# Altium schematic sheet Sheet2.SchDoc
size A3; SheetNumber: 2; SheetTotal: 3
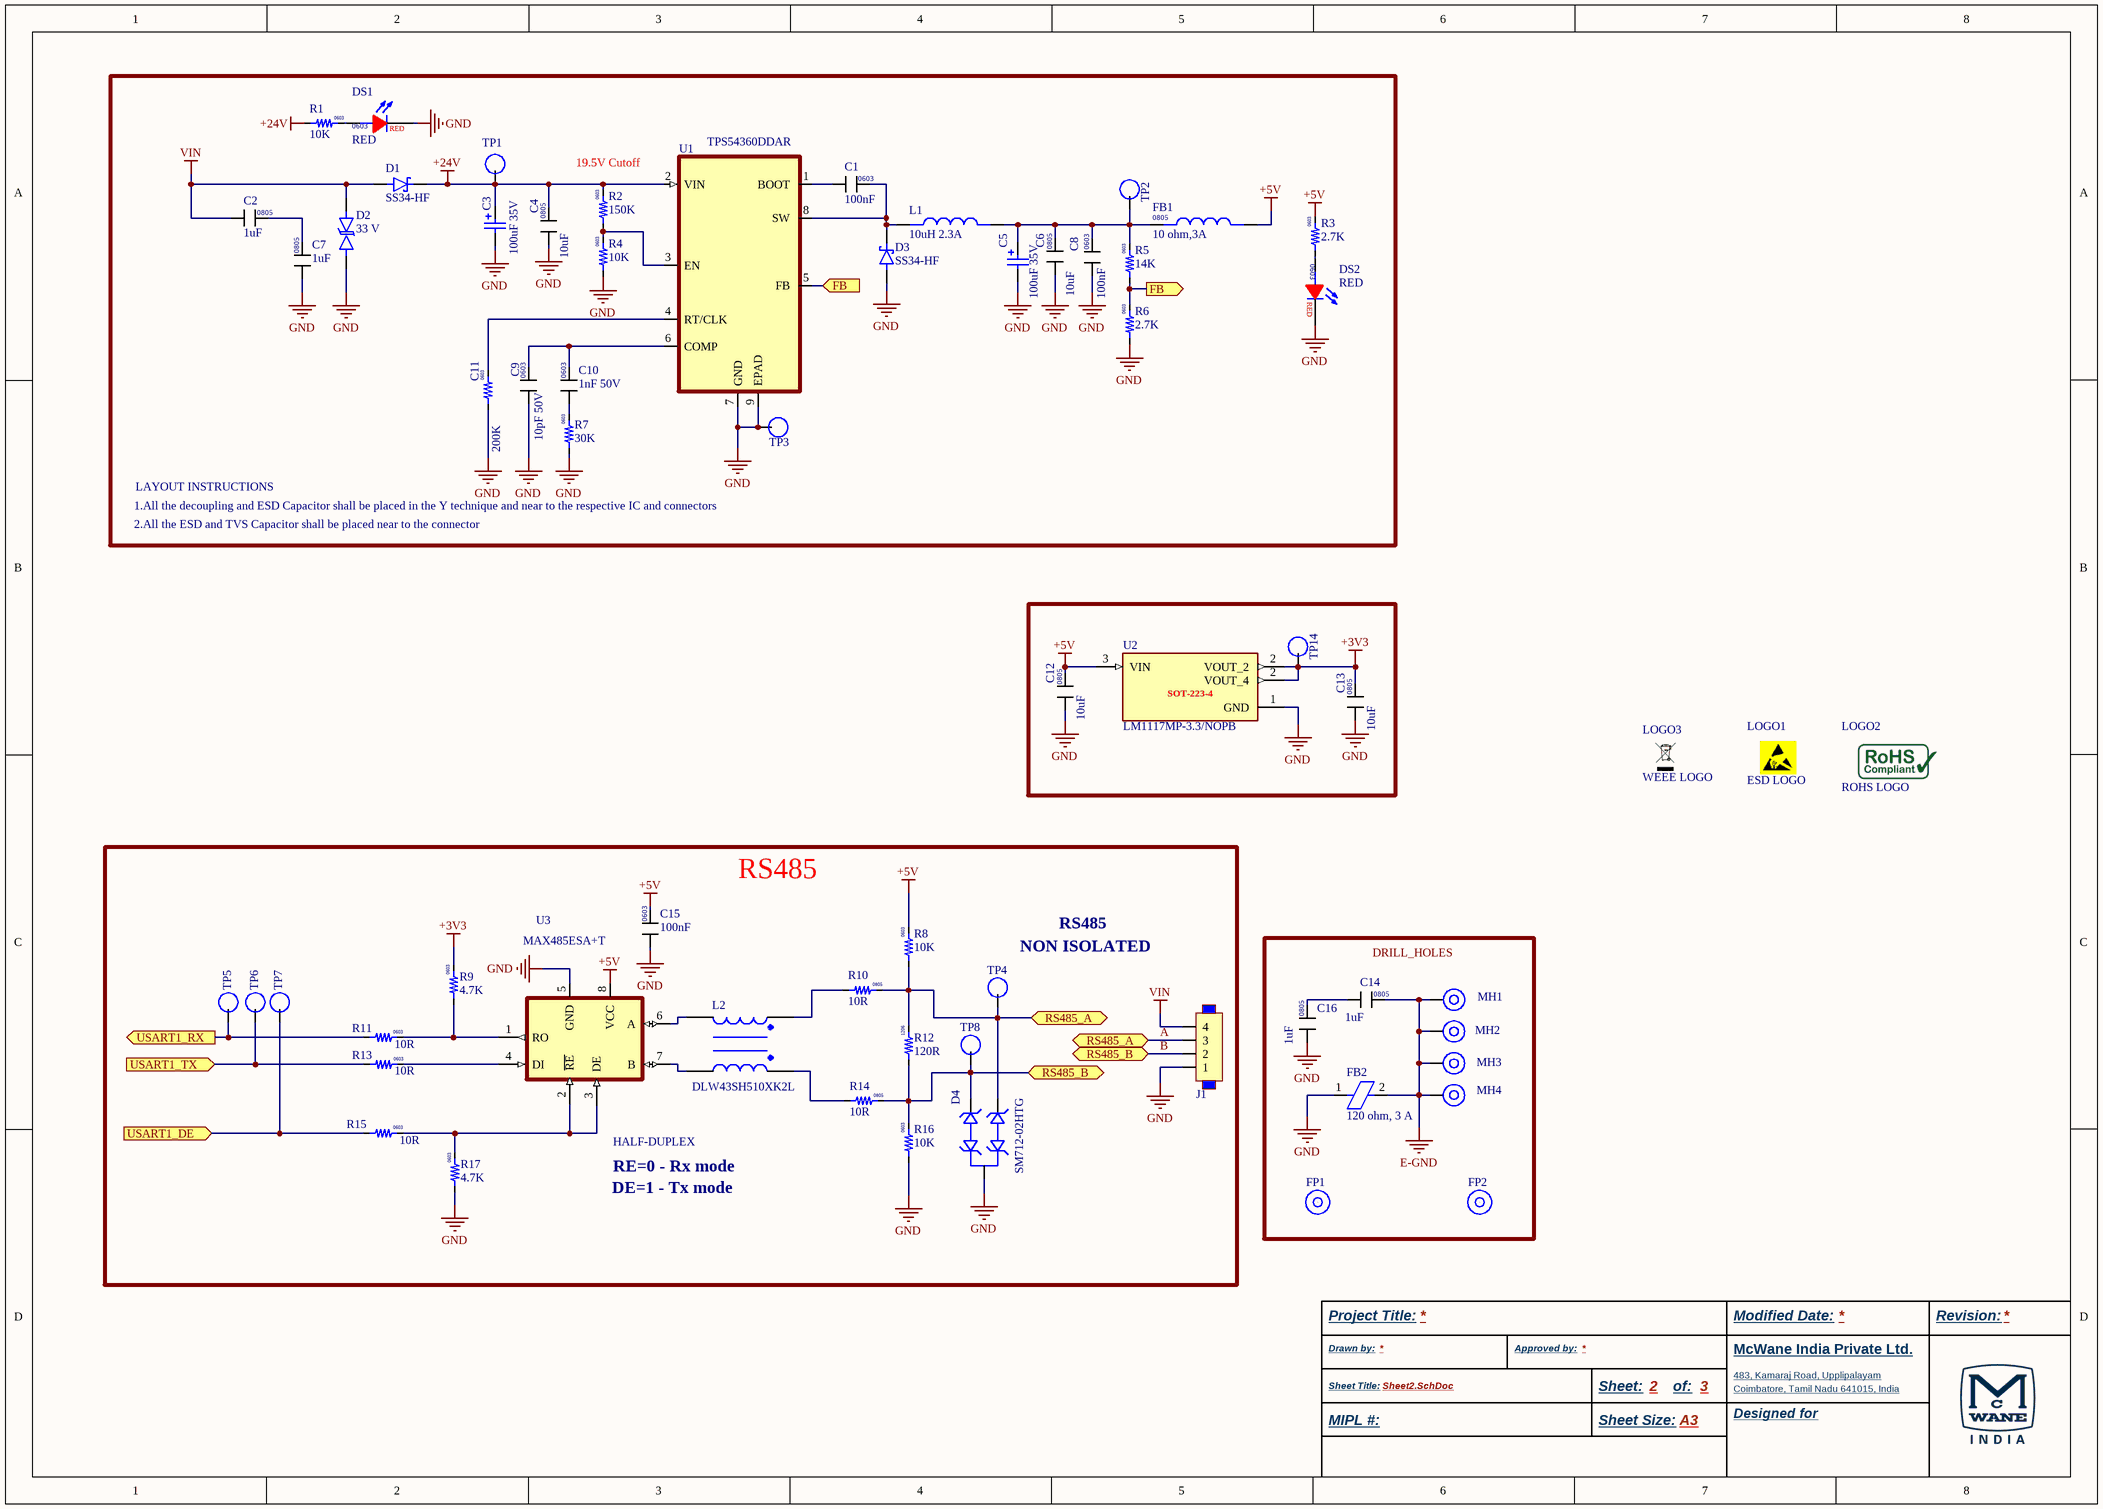
[diagram p0: Sheet2.SchDoc]

## Parts
C1  100nF  [CAP_0603]
C2  1uF  [CAP_0805]
C3  100uF 35V  [CAP_ELE_AL_6.3X7.7]
C4  10uF  [CAP_0805]
C5  100uF 35V  [CAP_ELE_AL_6.3X7.7]
C6  10uF  [CAP_0805]
C7  1uF  [CAP_0805]
C8  100nF  [CAP_0603]
C9  10pF 50V  [CAP_0603]
C10  1nF 50V  [CAP_0603]
C11  200K  [RES_0603]
C12  10uF  [CAP_0805]
C13  10uF  [CAP_0805]
C14  1uF  [CAP_0805]
C15  100nF  [CAP_0603]
C16  1uF  [CAP_0805]
D1  SS34-HF  [Diode_SMA_DO-214AC]
D2  33 V  [Diode_SMA_DO-214AC]
D3  SS34-HF  [Diode_SMA_DO-214AC]
D4  SM712-02HTG  [SOT23]
DS1  RED  [LED_0603]
DS2  RED  [LED_0603]
FB1  10 ohm,3A  [IND_0805]
FB2  120 ohm, 3 A  [IND_1206]
FP1  Fiducial_Point  [Fiducial_Point]  (value not drawn)
FP2  Fiducial_Point  [Fiducial_Point]  (value not drawn)
J1  WAGO250 104  [WAGO250_104]  (value not drawn)
L1  10uH 2.3A  [IND_SMD_7X7X5]
L2  DLW43SH510XK2L  [IND_CMC_SMD_4.5X3.2X2.6mm]
LOGO1  ESD LOGO  [ESD_LOGO]
LOGO2  ROHS LOGO  [ROHS_LOGO]
LOGO3  WEEE LOGO  [EWASTE_LOGO]
MH1  MOUNT_HOLE_4mm  [MOUNT_HOLE_4mm]  (value not drawn)
MH2  MOUNT_HOLE_4mm  [MOUNT_HOLE_4mm]  (value not drawn)
MH3  MOUNT_HOLE_4mm  [MOUNT_HOLE_4mm]  (value not drawn)
MH4  MOUNT_HOLE_4mm  [MOUNT_HOLE_4mm]  (value not drawn)
R1  10K  [RES_0603]
R2  150K  [RES_0603]
R3  2.7K  [RES_0603]
R4  10K  [RES_0603]
R5  14K  [RES_0603]
R6  2.7K  [RES_0603]
R7  30K  [RES_0603]
R8  10K  [RES_0603]
R9  4.7K  [RES_0603]
R10  10R  [RES_0805]
R11  10R  [RES_0603]
R12  120R  [RES_1206]
R13  10R  [RES_0603]
R14  10R  [RES_0805]
R15  10R  [RES_0603]
R16  10K  [RES_0603]
R17  4.7K  [RES_0603]
TP1  TP  [TEST_POINT_SMD]  (value not drawn)
TP2  TP  [TEST_POINT_SMD]  (value not drawn)
TP3  TP  [TEST_POINT_SMD]  (value not drawn)
TP4  TEST_POINT_SMD  [TEST_POINT_SMD]  (value not drawn)
TP5  TEST_POINT_SMD  [TEST_POINT_SMD]  (value not drawn)
TP6  TEST_POINT_SMD  [TEST_POINT_SMD]  (value not drawn)
TP7  TEST_POINT_SMD  [TEST_POINT_SMD]  (value not drawn)
TP8  TEST_POINT_SMD  [TEST_POINT_SMD]  (value not drawn)
TP14  TP  [TEST_POINT_SMD]  (value not drawn)
U1  TPS54360DDAR  [SOP127P600X175-9N]
U2  LM1117MP-3.3/NOPB  [SOT-223]
U3  MAX485ESA+T  [SOIC-8N]

## Blocks framed on the sheet
RS485: C15 D4 J1 L2 R8-R17 TP4-TP8 U3

## Ports
FB (in), FB (out), RS485_A (bidir), RS485_B (bidir), USART1_DE (in), USART1_RX (out), USART1_TX (in)

## Nets
+3V3: C13.2 R9.2 TP14.1 U2.2(VOUT_2)
+5V: C12.2 C15.2 FB1.2 R3.2 R8.2 U2.3(VIN) U3.8(VCC)
+24V: C3.2(P) C4.2 D1.C R1.1 R2.2 TP1.1 U1.2(VIN)
E-GND: C14.2 FB2.2 MH1.1 MH2.1 MH3.1 MH4.1
GND: C3.1(N) C4.1 C5.1(N) C6.1 C7.1 C8.1 C9.1 C11.1 C12.1 C13.1 C15.1 C16.1 D2.C D3.A D4.3(GND) DS1.C DS2.C FB2.1 J1.1 R4.1 R6.1 R7.1 R16.1 R17.1 TP3.1 U1.7(GND) U1.9(EPAD) U2.1(GND) U3.5(GND)
VIN: C2.1 D1.A D2.A J1.4
A: D4.2(IO2) J1.3 R8.1 R10.2 R12.2 TP4.1 ; port RS485_A
B: D4.1(IO1) J1.2 R12.1 R14.2 R16.2 TP8.1 ; port RS485_B
FB: R5.1 R6.2 U1.5(FB) ; port FB
USART1_DE: R15.1 TP7.1 ; port USART1_DE
USART1_RX: R11.1 TP5.1 ; port USART1_RX
USART1_TX: R13.1 TP6.1 ; port USART1_TX
NetC1_1: C1.1 U1.1(BOOT)
NetC1_2: C1.2 D3.C L1.1 U1.8(SW)
NetC2_2: C2.2 C7.2
NetC5_2: C5.2(P) C6.2 C8.2 FB1.1 L1.2 R5.2 TP2.1
NetC9_2: C9.2 C10.2 U1.6(COMP)
NetC10_1: C10.1 R7.2
NetC11_2: C11.2 U1.4(RT/CLK)
NetC14_1: C14.1 C16.2
NetDS1_A: DS1.A R1.2
NetDS2_A: DS2.A R3.1
NetL2_1: L2.1 R14.1
NetL2_2: L2.2 U3.7(B)
NetL2_3: L2.3 U3.6(A)
NetL2_4: L2.4 R10.1
NetR2_1: R2.1 R4.2 U1.3(EN)
NetR9_1: R9.1 R11.2 U3.1(RO)
NetR13_2: R13.2 U3.4(DI)
NetR15_2: R15.2 R17.2 U3.2(~{RE}) U3.3(DE)

Not connected (* = marked no-connect by the designer): FP1 1; FP2 1

## Notes on the sheet
- 19.5V Cutoff
- 1.All the decoupling and ESD Capacitor shall be placed in the Y technique and near to the respective IC and connectors
- LAYOUT INSTRUCTIONS
- 2.All the ESD and TVS Capacitor shall be placed near to the connector
- (near TP4) NON ISOLATED
- RS485
- DE=1 - Tx mode
- RE=0 - Rx mode
- HALF-DUPLEX
- Labels drawn without touching a wire or pin: DRILL_HOLES
- Project Title:
- Modified Date:
- Revision:
- Drawn by:
- Sheet Title:
- Approved by:
- Sheet:
- of:
- McWane India Private Ltd.
- 483, Kamaraj Road, Upplipalayam
- Coimbatore, Tamil Nadu 641015, India
- MIPL #:
- Sheet Size:
- A3
- Designed for

## Library data of the parts
C1 C8 C15 = C0603-0.1uF 50V-MLCC: SMD Multilayer Ceramic Capacitor, 0.1 µF, 50 V, 0603 [1608 Metric], ± 10%, X7R; Manufacturer Part Number: CC0603KRX7R9BB104; Brand: YAGEO; Marking: 104; Package: 0603; Supplier: ELEMENT 14; Component: Capacitor; LCSC Part: C14663
C2 C7 C14 C16 = C0805-1uF 50V-MLCC: SMD Multilayer Ceramic Capacitor, 1 µF, 50 V, 0805 [2012 Metric], ± 10%, X7R, -55 °C; Manufacturer Part Number: CC0805KKX7R9BB105; Marking: 105; Brand: YAGEO; Package: 0805; Component: Capacitor; LCSC Part: C91185
C3 C5 = CAP_SMD_100uF_35V: SMD Aluminium Electrolytic Capacitor, Radial Can - SMD, 100 µF, 35 V, 2000 hours @ 105°C, Polar; Manufacturer Part Number: MCVVT035M101EA6L; Brand: MULTICOMP PRO; Package: 6.3X7.7mm; Marking: *; Supplier: Element 14; Component: Capacitor
C4 C6 C12 C13 = C0805-10uF 50V-MLCC: SMD Multilayer Ceramic Capacitor, 10 µF, 50 V, 0805 [2012 Metric], ± 10%, X5R; Manufacturer Part Number: CC0805KKX5R9BB106; Brand: YAGEO; Marking: 106; Package: 0805; Component: Capacitor; Supplier: DIGI-KEY; LCSC Part: C440198
C9 = C0603-10pF 50V-MLCC: SMD Multilayer Ceramic Capacitor, 10 pF, 50 V, 0603 [1608 Metric], ± 10%, C0G / NP0, -55 °C; Manufacturer Part Number: CC0603KRNPO9BN100; Brand: YAGEO; Marking: 100; Package: 0603; Supplier: ELEMENT 14; Component: Capacitor
C10 = C0603-1nF 50V-MLCC: SMD Multilayer Ceramic Capacitor, 1 nF, 50 V, 0603 [1608 Metric], ± 10%, X7R; Manufacturer Part Number: CC0603KRX7R9BB102; Brand: YAGEO; Marking: ELEMENT 14; Package: 0603; Supplier: 102; Component: Capacitor
C11 = R0603-200K-1%: SMD Chip Resistor, 200 kohm, ± 1%, 100 mW, 0603 [1608 Metric], Thick Film, General Purpose; Manufacturer Part Number: RC0603FR-07200KL; Brand: YAGEO; Marking: 2003; Package: 0603; Supplier: ELEMENT 14; Component: Resistor
D1 D3 = SS34-HF: Schottky Rectifier, SSxx Series, 40 V, 3 A, Single, DO-214AC (SMA), 2 Pins, 500 mV; Brand: Comchip Technology; Package: DO-214AC (SMA); Manufacturer Part Number: SS34-HF
D2 = SMAJ33CAHE3_A/H_1: TVS Diode, TRANSZORB SMAJ, Bidirectional, 33 V, 53.3 V, DO-214AC (SMA), 2 Pins; Brand: Vishay General Semiconductor; Package: DO-214AC-2; Manufacturer Part Number: SMAJ33CAHE3_A/H; Marking: *; Supplier: *
D4 = ESD_RS485_SM712: ESD Protection Device, 31 V, SOT-23, 3 Pins, 12 V, 600 W, SPA SM712; Brand: LITTELFUSE; Manufacturer Part Number: SM712-02HTG; Supplier: *; Package: SOT-23-3; Marking: *
DS1 DS2 = 19-217/R6C-AL1M2VY/3T: Red LED Indication - Discrete 1.95V 0603 (1608 Metric); Brand: Everlight Elec; Package: 0603; Manufacturer Part Number: 19-217/R6C-AL1M2VY/3T; LCSC Part: C72044
FB1 = IND_0805: 10 Ohms @ 100 MHz 1 Signal Line Ferrite Bead 0805 (2012 Metric) 3A 25mOhm; Manufacturer Part Number: 742792011; Brand: Wurth Elektronik; Component: Indutor; Package: 0805; Supplier: Mouser Electronics
FB2 = 742792113: Ferrite Bead, 1206 [3216 Metric], 120 ohm, 3 A, WE-CBF, 0.03 ohm, ± 25%; Brand: WURTH ELEKTRONIK; Package: 1206; Manufacturer Part Number: 742792113
J1 = WAGO250_104: 4 Position Wire to Board Terminal Block 45° (135°) Angle with Board 0.138" (3.50mm) Through Hole; Manufacturer Part Number: 250-104/000-012; Brand: WAGO Corporation; Supplier: *; Marking: *; Package: 3.5mm
L1 = IND_10uH_2.3A: 10 µH Unshielded Inductor 2.3 A 70mOhm Max Nonstandard; Manufacturer Part Number: CD75NP-100KC; Brand: Sumida America Components Inc.; Package: 0.307" L x 0.276" W (7.80mm x 7.00mm); Component: Inductor; Marking: *; LCSC Part: C2454030
L2 = DLW43SH510XK2L: 51 µH @ 1 MHz 2 Line Common Mode Choke Surface Mount 230mA DCR 1Ohm; Brand: MURATA; Package: 4.5mm x3.2mm x 2.6mm; Manufacturer Part Number: DLW43SH510XK2L; Supplier: Digikey; Marking: *; Supplier PN: C91595
LOGO1 = ESD_LOGO
LOGO2 = ROHS_LOGO
LOGO3 = WEEE_LOGO
R1 R4 R8 R16 = R0603-10K-1%: SMD Chip Resistor, 10 kohm, ± 1%, 100 mW, 0603 [1608 Metric], Thick Film, General Purpose; Manufacturer Part Number: RC0603FR-0710KL; Brand: YAGEO; Marking: 1002; Package: 0603; Supplier: ELEMENT 14; Component: Resistor; LCSC Part: C98220
R2 = R0603-150K-1%: SMD Chip Resistor, 150 kohm, ± 1%, 100 mW, 0603 [1608 Metric], Thick Film, General Purpose; Manufacturer Part Number: RC0603FR-07150KL; Brand: YAGEO; Marking: 1503; Package: 0603; Supplier: ELEMENT 14; Component: Resistor
R3 R6 = R0603-2.7K-1%: SMD Chip Resistor, 2.7 kohm, ± 1%, 100 mW, 0603 [1608 Metric], Thick Film, General Purpose; Manufacturer Part Number: RC0603FR-072K7L; Brand: YAGEO; Marking: 2701; Package: 0603; Supplier: ELEMENT 14; Component: Resistor
R5 = R0603-14K-1%: SMD Chip Resistor, 14 kohm, ± 1%, 100 mW, 0603 [1608 Metric], Thick Film, General Purpose; Manufacturer Part Number: RC0603FR-0714KL; Brand: YAGEO; Package: 0603; Component: Resistor
R7 = R0603-30K-1%: SMD Chip Resistor, 30 kohm, ± 1%, 100 mW, 0603 [1608 Metric], Thick Film, General Purpose; Manufacturer Part Number: RC0603FR-0730KL; Brand: YAGEO; Marking: 3002; Package: 0603; Supplier: ELEMENT 14; Component: Resistor
R9 R17 = R0603-4.7K-1%: SMD Chip Resistor, 4.7 kohm, ± 1%, 100 mW, 0603 [1608 Metric], Thick Film, General Purpose; Manufacturer Part Number: RC0603FR-074K7L.; Brand: YAGEO; Marking: 4701; Package: 0603; Supplier: ELEMENT 14; Component: Resistor
R10 R14 = R0805-10R-1%: SMD Chip Resistor, 10 ohm, ± 1%, 125 mW, 0805 [2012 Metric], Thick Film, General Purpose; Manufacturer Part Number: RC0805FR-0710RL; Brand: YAGEO; Marking: 10R0; Supplier: ELEMENT 14; Package: 0805; Component: Resistor; LCSC Part: C96347
R11 R13 R15 = R0603-10E-1%: SMD Chip Resistor, 10 ohm, ± 1%, 100 mW, 0603 [1608 Metric], Thick Film, General Purpose; Manufacturer Part Number: RC0603FR-0710RL; Marking: 10RO; Brand: YAGEO; Supplier: ELEMENT 14; Package: 0603; Component: Resistor; LCSC Part: C109318
R12 = R1206-120E-1%: SMD Chip Resistor, 120 ohm, ± 1%, 250 mW, 1206 [3216 Metric], Thick Film, General Purpose; Manufacturer Part Number: RC1206FR-07120RL; Brand: YAGEO; Package: 1206; Supplier: ELEMENT 14; Marking: 120R; Component: Resistor; LCSC Part: C114928
TP1-TP3 TP14 = TEST_POINT_SMD
U1 = TPS54360DDAR: Buck, Split Rail Switching Regulator IC Positive Adjustable 0.8V 1 Output 3.5A 8-PowerSOIC (0.154", 3.90mm Width); Brand: TEXAS INSTRUMENTS; Package: 8-SO PowerPad; Manufacturer Part Number: TPS54360DDAR; Website: https://www.ti.com/lit/ds/symlink/tps54360.pdf?ts=1703662766312&ref_url=https%253A%252F%252Fwww.ti.com%252Fproduct%252FTPS54360; Stock: *
U2 = LM1117IMPX-3.3/NOPB: Fixed LDO Voltage Regulator, 15V in, 1.2V Dropout, 3.3V/800mA out, SOT-223-4; Brand: Texas Instruments; Supplier: *; Manufacturer Part Number: LM1117MP-3.3/NOPB; Marking: *; Package: SOT-223-4; LCSC Part: C79401
U3 = MAX487ESA+T: Transceiver RS422, RS485, 4.75V-5.25V supply, 1 Driver, NSOIC-8; Brand: MAXIM INTEGRATED; Package: NSOIC-8; Manufacturer Part Number: MAX487ESA+T; Marking: *; Supplier: *